# Altium project MandevicesGPSGSM.PrjPcb
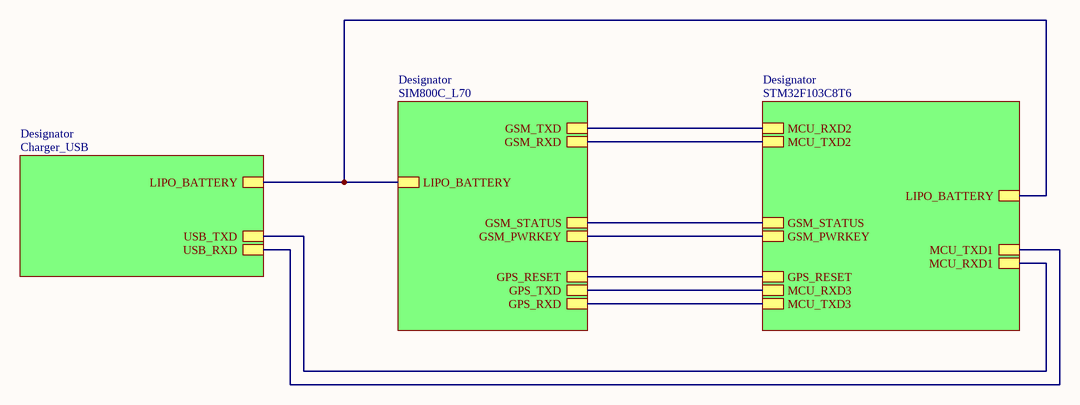
[diagram p0: Sheet1.SchDoc]
5 sheets, 103 parts. Net scope: hierarchical (ports join the sheet entries above them; power ports are global).
Board file: PCB1.PcbDoc
Sheets:
  Sheet1.SchDoc
    Designator = SIM800C_L70.SchDoc
    Designator = STM32F103C8T6.SchDoc
    Designator = Charger_USB.SchDoc
  Diagram.SchDoc

## Sheet Sheet1.SchDoc
size A; SheetNumber: 1; SheetTotal: 4

### Sub-sheets
Designator = SIM800C_L70: GSM_TXD, GSM_RXD, GSM_STATUS, GSM_PWRKEY, LIPO_BATTERY, GPS_TXD, GPS_RXD, GPS_RESET
Designator = STM32F103C8T6: MCU_RXD2, MCU_TXD2, GSM_STATUS, GSM_PWRKEY, MCU_RXD3, MCU_TXD3, GPS_RESET, LIPO_BATTERY, MCU_TXD1, MCU_RXD1
Designator = Charger_USB: LIPO_BATTERY, USB_TXD, USB_RXD

### Nets
LIPO_BATTERY: sheet Designator/LIPO_BATTERY, sheet Designator/LIPO_BATTERY, sheet Designator/LIPO_BATTERY
NetR9_1: sheet Designator/GPS_RESET, sheet Designator/GPS_RESET
NetR20_1: sheet Designator/GSM_RXD, sheet Designator/MCU_TXD2
NetR21_1: sheet Designator/GSM_TXD, sheet Designator/MCU_RXD2
NetR24_1: sheet Designator/GSM_PWRKEY, sheet Designator/GSM_PWRKEY
NetU4_2: sheet Designator/MCU_RXD1, sheet Designator/USB_TXD
NetU4_3: sheet Designator/MCU_TXD1, sheet Designator/USB_RXD
NetU5_42: sheet Designator/GSM_STATUS, sheet Designator/GSM_STATUS
NetU6_2: sheet Designator/GPS_TXD, sheet Designator/MCU_RXD3
NetU6_3: sheet Designator/GPS_RXD, sheet Designator/MCU_TXD3

## Sheet SIM800C_L70.SchDoc
size A3; SheetNumber: 3; SheetTotal: 4
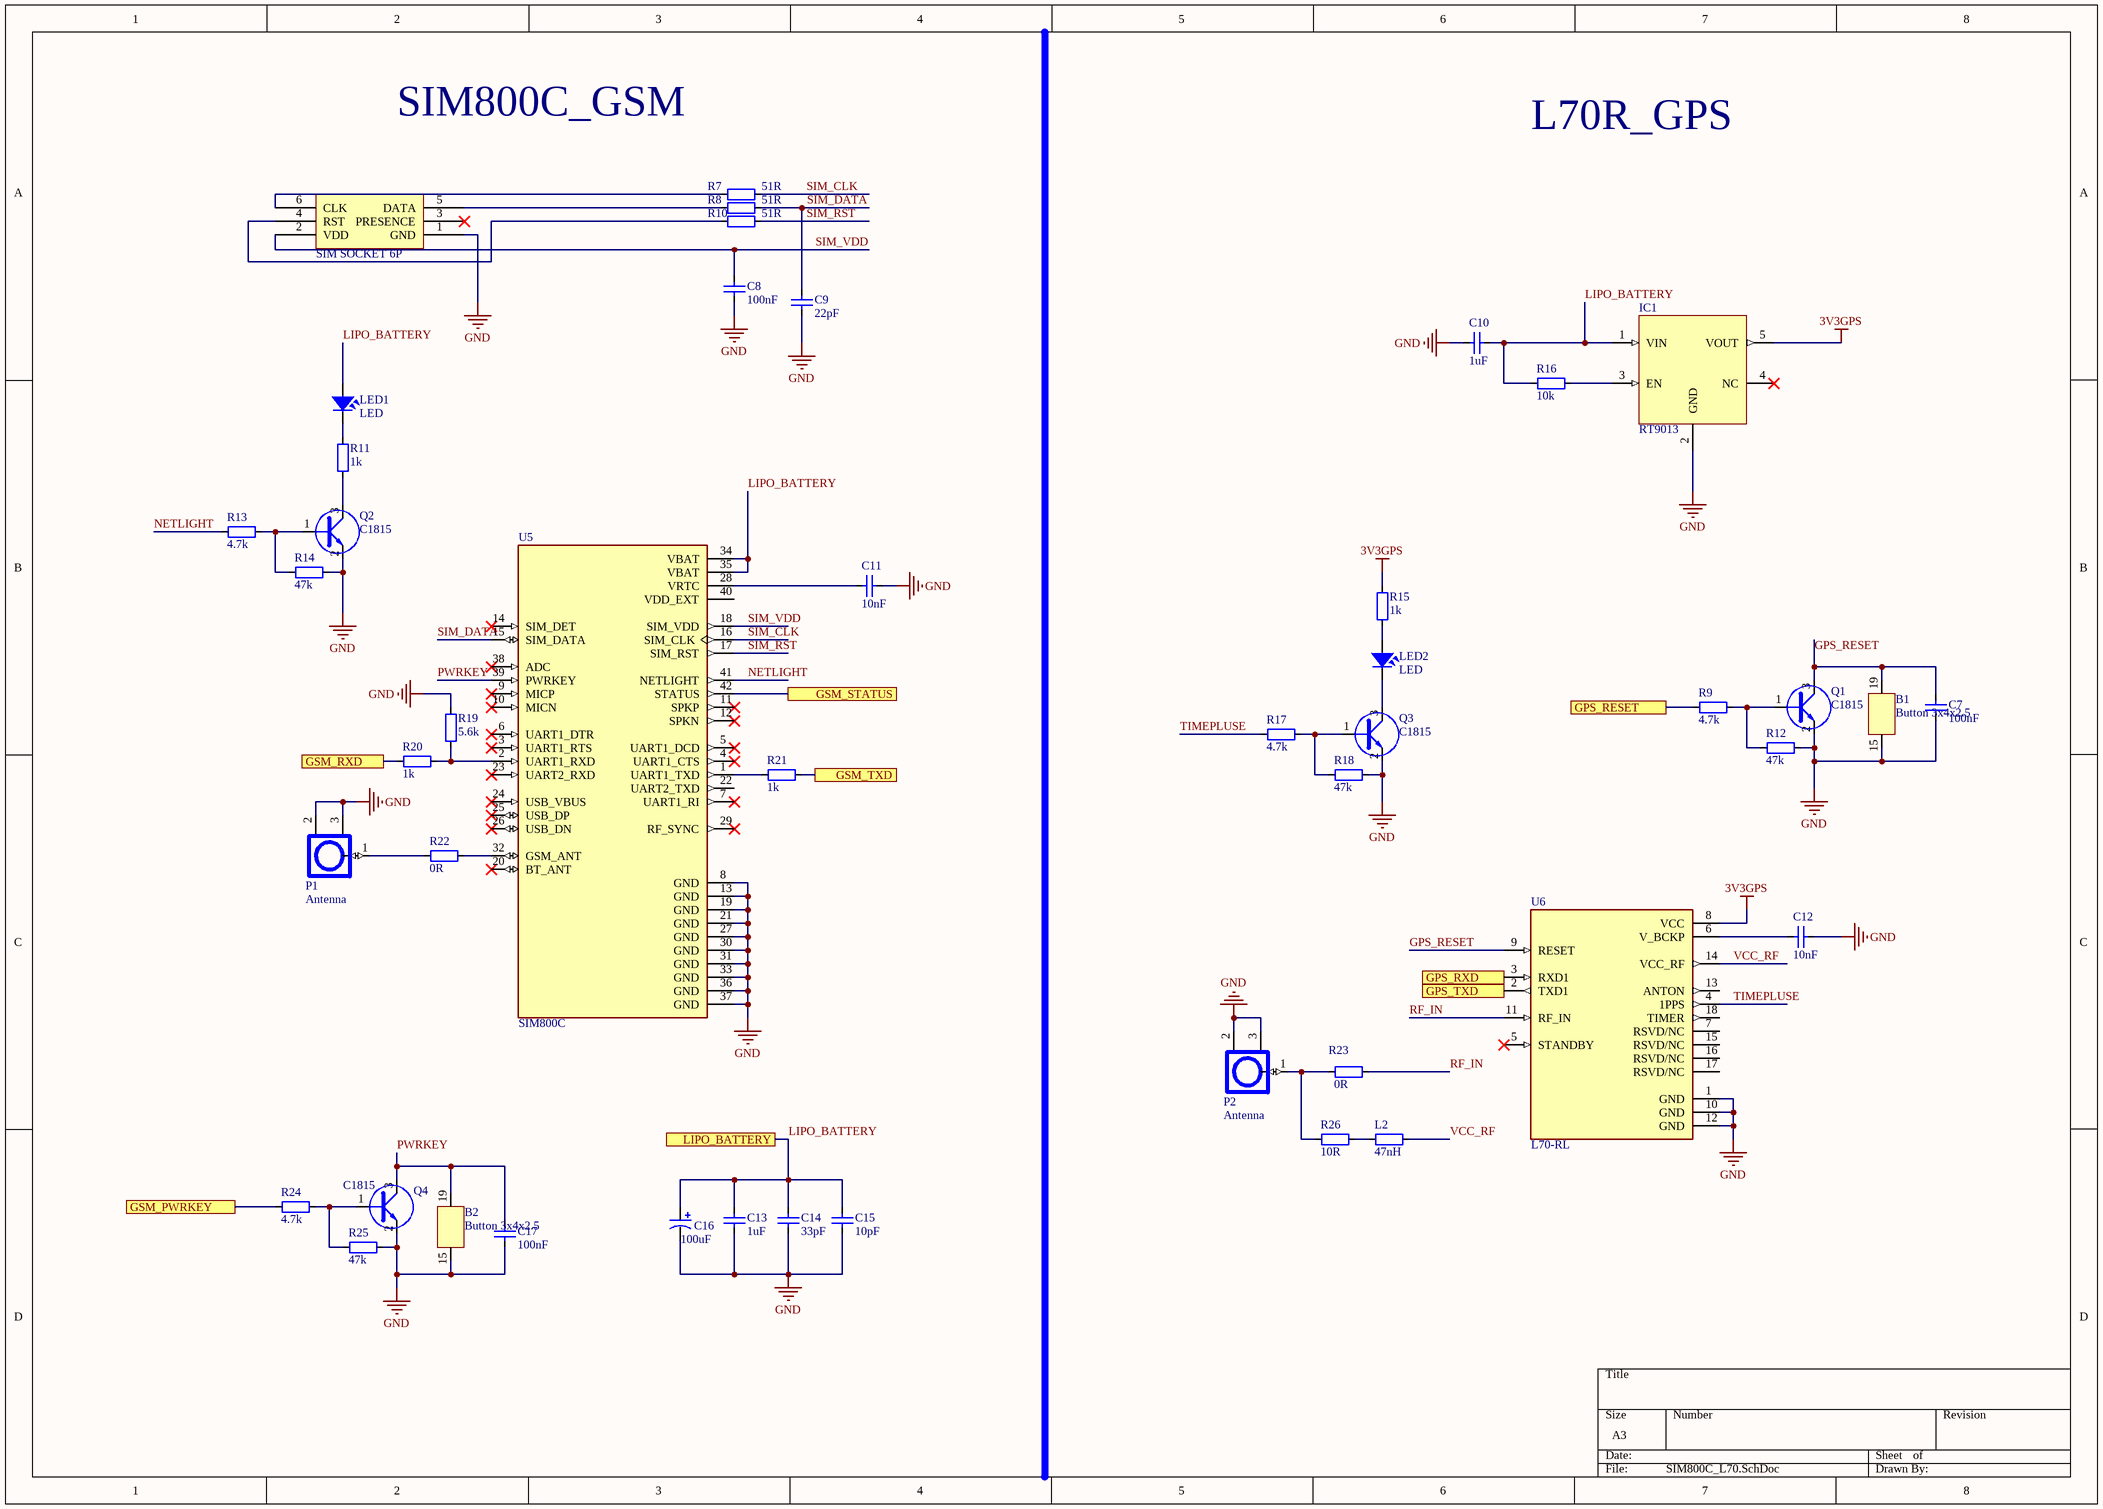
[diagram p1: SIM800C_L70.SchDoc]

### Parts
B1  Button 3x4x2.5  [Button 3x4x2.5]
B2  Button 3x4x2.5  [Button 3x4x2.5]
C7  100nF  [CAP_0805]
C8  100nF  [CAP_0805]
C9  22pF  [CAP_0805]
C10  1uF  [CAP_0805]
C11  10nF  [CAP_0805]
C12  10nF  [CAP_0805]
C13  1uF  [CAP_0805]
C14  33pF  [CAP_0805]
C15  10pF  [CAP_0805]
C16  100uF  [CAP_7343]
C17  100nF  [CAP_0805]
IC1  RT9013  [SOT23-5]
L2  47nH  [RES-SMD-0805]
LED1  LED  [LED-0805-Red]
LED2  LED  [LED-0805-Red]
P1  Antenna  [IPXS]
P2  Antenna  [IPXS]
Q1  C1815  [SOT23D]
Q2  C1815  [SOT23D]
Q3  C1815  [SOT23D]
Q4  C1815  [SOT23D]
R7  51R  [RES-SMD-0805]
R8  51R  [RES-SMD-0805]
R9  4.7k  [RES-SMD-0805]
R10  51R  [RES-SMD-0805]
R11  1k  [RES-SMD-0805]
R12  47k  [RES-SMD-0805]
R13  4.7k  [RES-SMD-0805]
R14  47k  [RES-SMD-0805]
R15  1k  [RES-SMD-0805]
R16  10k  [RES-SMD-0805]
R17  4.7k  [RES-SMD-0805]
R18  47k  [RES-SMD-0805]
R19  5.6k  [RES-SMD-0805]
R20  1k  [RES-SMD-0805]
R21  1k  [RES-SMD-0805]
R22  0R  [RES-SMD-0805]
R23  0R  [RES-SMD-0805]
R24  4.7k  [RES-SMD-0805]
R25  47k  [RES-SMD-0805]
R26  10R  [RES-SMD-0805]
SIM1  SIM SOCKET 6P  [SIM SOCKET 6P]
U5  SIM800C  [LCC110P1570X1760X250-42N]
U6  L70-RL  [XCVR_L70-RL]

### Ports
GPS_RESET, GPS_RXD, GPS_TXD, GSM_PWRKEY, GSM_RXD, GSM_STATUS, GSM_TXD, LIPO_BATTERY

### Nets
3V3GPS: IC1.5(VOUT) R15.2 U6.8(VCC)
GND: B1.15 B2.15 C7.1 C8.2 C9.1 C10.1 C11.2 C12.2 C13.2 C14.2 C15.2 C16.2 C17.1 IC1.2(GND) P1.2 P1.3 P2.2 P2.3 Q1.2(E) Q2.2(E) Q3.2(E) Q4.2(E) R12.2 R14.2 R18.2 R19.1 R25.2 SIM1.1(GND) U5.8(GND) U5.13(GND) U5.19(GND) U5.21(GND) U5.27(GND) U5.30(GND) U5.31(GND) U5.33(GND) U5.36(GND) U5.37(GND) U6.1(GND) U6.10(GND) U6.12(GND)
GPS_RESET: B1.19 C7.2 Q1.3(C) U6.9(RESET)
LIPO_BATTERY: C10.2 C13.1 C14.1 C15.1 C16.1 IC1.1(VIN) LED1.1 R16.2 U5.34(VBAT) U5.35(VBAT) ; port LIPO_BATTERY
NETLIGHT: R13.1 U5.41(NETLIGHT)
PWRKEY: B2.19 C17.2 Q4.3(C) U5.39(PWRKEY)
RF_IN: R23.2 U6.11(RF_IN)
SIM_CLK: R7.2 U5.16(SIM_CLK)
SIM_DATA: C9.2 R8.2 U5.15(SIM_DATA)
SIM_RST: R10.2 U5.17(SIM_RST)
SIM_VDD: C8.1 SIM1.2(VDD) U5.18(SIM_VDD)
TIMEPLUSE: R17.1 U6.4(1PPS)
VCC_RF: L2.2 U6.14(VCC_RF)
NetC11_1: C11.1 U5.28(VRTC)
NetC12_1: C12.1 U6.6(V_BCKP)
NetIC1_3: IC1.3(EN) R16.1
NetL2_1: L2.1 R26.2
NetLED1_2: LED1.2 R11.2
NetLED2_1: LED2.1 R15.1
NetLED2_2: LED2.2 Q3.3(C)
NetP1_1: P1.1 R22.2
NetP2_1: P2.1 R23.1 R26.1
NetQ1_1: Q1.1(B) R9.2 R12.1
NetQ2_1: Q2.1(B) R13.2 R14.1
NetQ2_3: Q2.3(C) R11.1
NetQ3_1: Q3.1(B) R17.2 R18.1
NetQ4_1: Q4.1(B) R24.2 R25.1
NetR7_1: R7.1 SIM1.6(CLK)
NetR8_1: R8.1 SIM1.5(DATA)
NetR9_1: R9.1 ; port GPS_RESET
NetR10_1: R10.1 SIM1.4(RST)
NetR19_2: R19.2 R20.2 U5.2(UART1_RXD)
NetR20_1: R20.1 ; port GSM_RXD
NetR21_1: R21.1 ; port GSM_TXD
NetR21_2: R21.2 U5.1(UART1_TXD)
NetR22_1: R22.1 U5.32(GSM_ANT)
NetR24_1: R24.1 ; port GSM_PWRKEY
NetU5_42: U5.42(STATUS) ; port GSM_STATUS
NetU6_2: U6.2(TXD1) ; port GPS_TXD
NetU6_3: U6.3(RXD1) ; port GPS_RXD

Not connected (* = marked no-connect by the designer): IC1 4(NC)*; SIM1 3(PRESENCE)*; U5 3(UART1_RTS)* 4(UART1_CTS)* 5(UART1_DCD)* 6(UART1_DTR)* 7(UART1_RI)* 9(MICP)* 10(MICN)* 11(SPKP)* 12(SPKN)* 14(SIM_DET)* 20(BT_ANT)* 22(UART2_TXD) 23(UART2_RXD)* 24(USB_VBUS)* 25(USB_DP)* 26(USB_DN)* 29(RF_SYNC)* 38(ADC)* 40(VDD_EXT); U6 5(STANDBY)* 7(RSVD/NC) 13(ANTON) 15(RSVD/NC) 16(RSVD/NC) 17(RSVD/NC) 18(TIMER)

### Notes on the sheet
- SIM800C_GSM
- L70R_GPS

### Library data of the parts
C7-C15 C17 = CapSMD: Capacitor; Value: 33p; Published: 8-Jun-2000; LatestRevisionDate: 17-Jul-2002; LatestRevisionNote: Re-released for DXP Platform.; PackageReference: RAD-0.3; Publisher: Altium Limited
C16 = CAP_TAN_SMD: Polazied Tantalum Capacitor
IC1 = RT9013: RT9013-33GB IC REG LINEAR 3.3V 500mA SOT23-5
L2 R7-R26 = Resistor - SMD: Resistor; Manufacturer: Generic Components; Class: Passive; Published: 08/06/2000; Publisher: Altium Hobart Technology Centre
LED1 LED2 = LED: LED Single colour Green and Red; Value: LED 3 ly Single Colour
P1 P2 = IPXSx66: Antenna GSM GPS
Q1-Q4 = 2SC1815: NPN 600mW, ECB; Value: C1815
SIM1 = SIM SOCKET 6P: Ma_Hang: MH001823; Ten_LK: Socket SIM 6P SK06
U5 = SIM800C: Module: GSM/Bluetooth; GPRS; 2G; 1800MHz, 900MHz; 85.6kbps; SMD; MF: Simcom; MP: SIM800C; Availability: Unavailable; Package: None; Value: *; Price: None; SnapEDA_Link: https://www.snapeda.com/parts/SIM800C/SIMcom%20Wireless%20solutions%20Co.%2CLtd/view-part/571323/?ref=snap
U6 = L70-RL: L70-RL, a low cost ROM-based GPS module, brings the high performance of MTK positioning engine to industrial applications with its compact profile, ultra low power consumption and fast positioning capability; MF: Quectel; Availability: Not in stock; Price: None; Package: None; SnapEDA_Link: https://www.snapeda.com/parts/L70-RL/Quectel/view-part/?ref=snap; MP: L70-RL; Value: *; Check_prices: https://www.snapeda.com/parts/L70-RL/Quectel/view-part/?ref=eda

## Sheet STM32F103C8T6.SchDoc
size A3; SheetNumber: 4; SheetTotal: 4
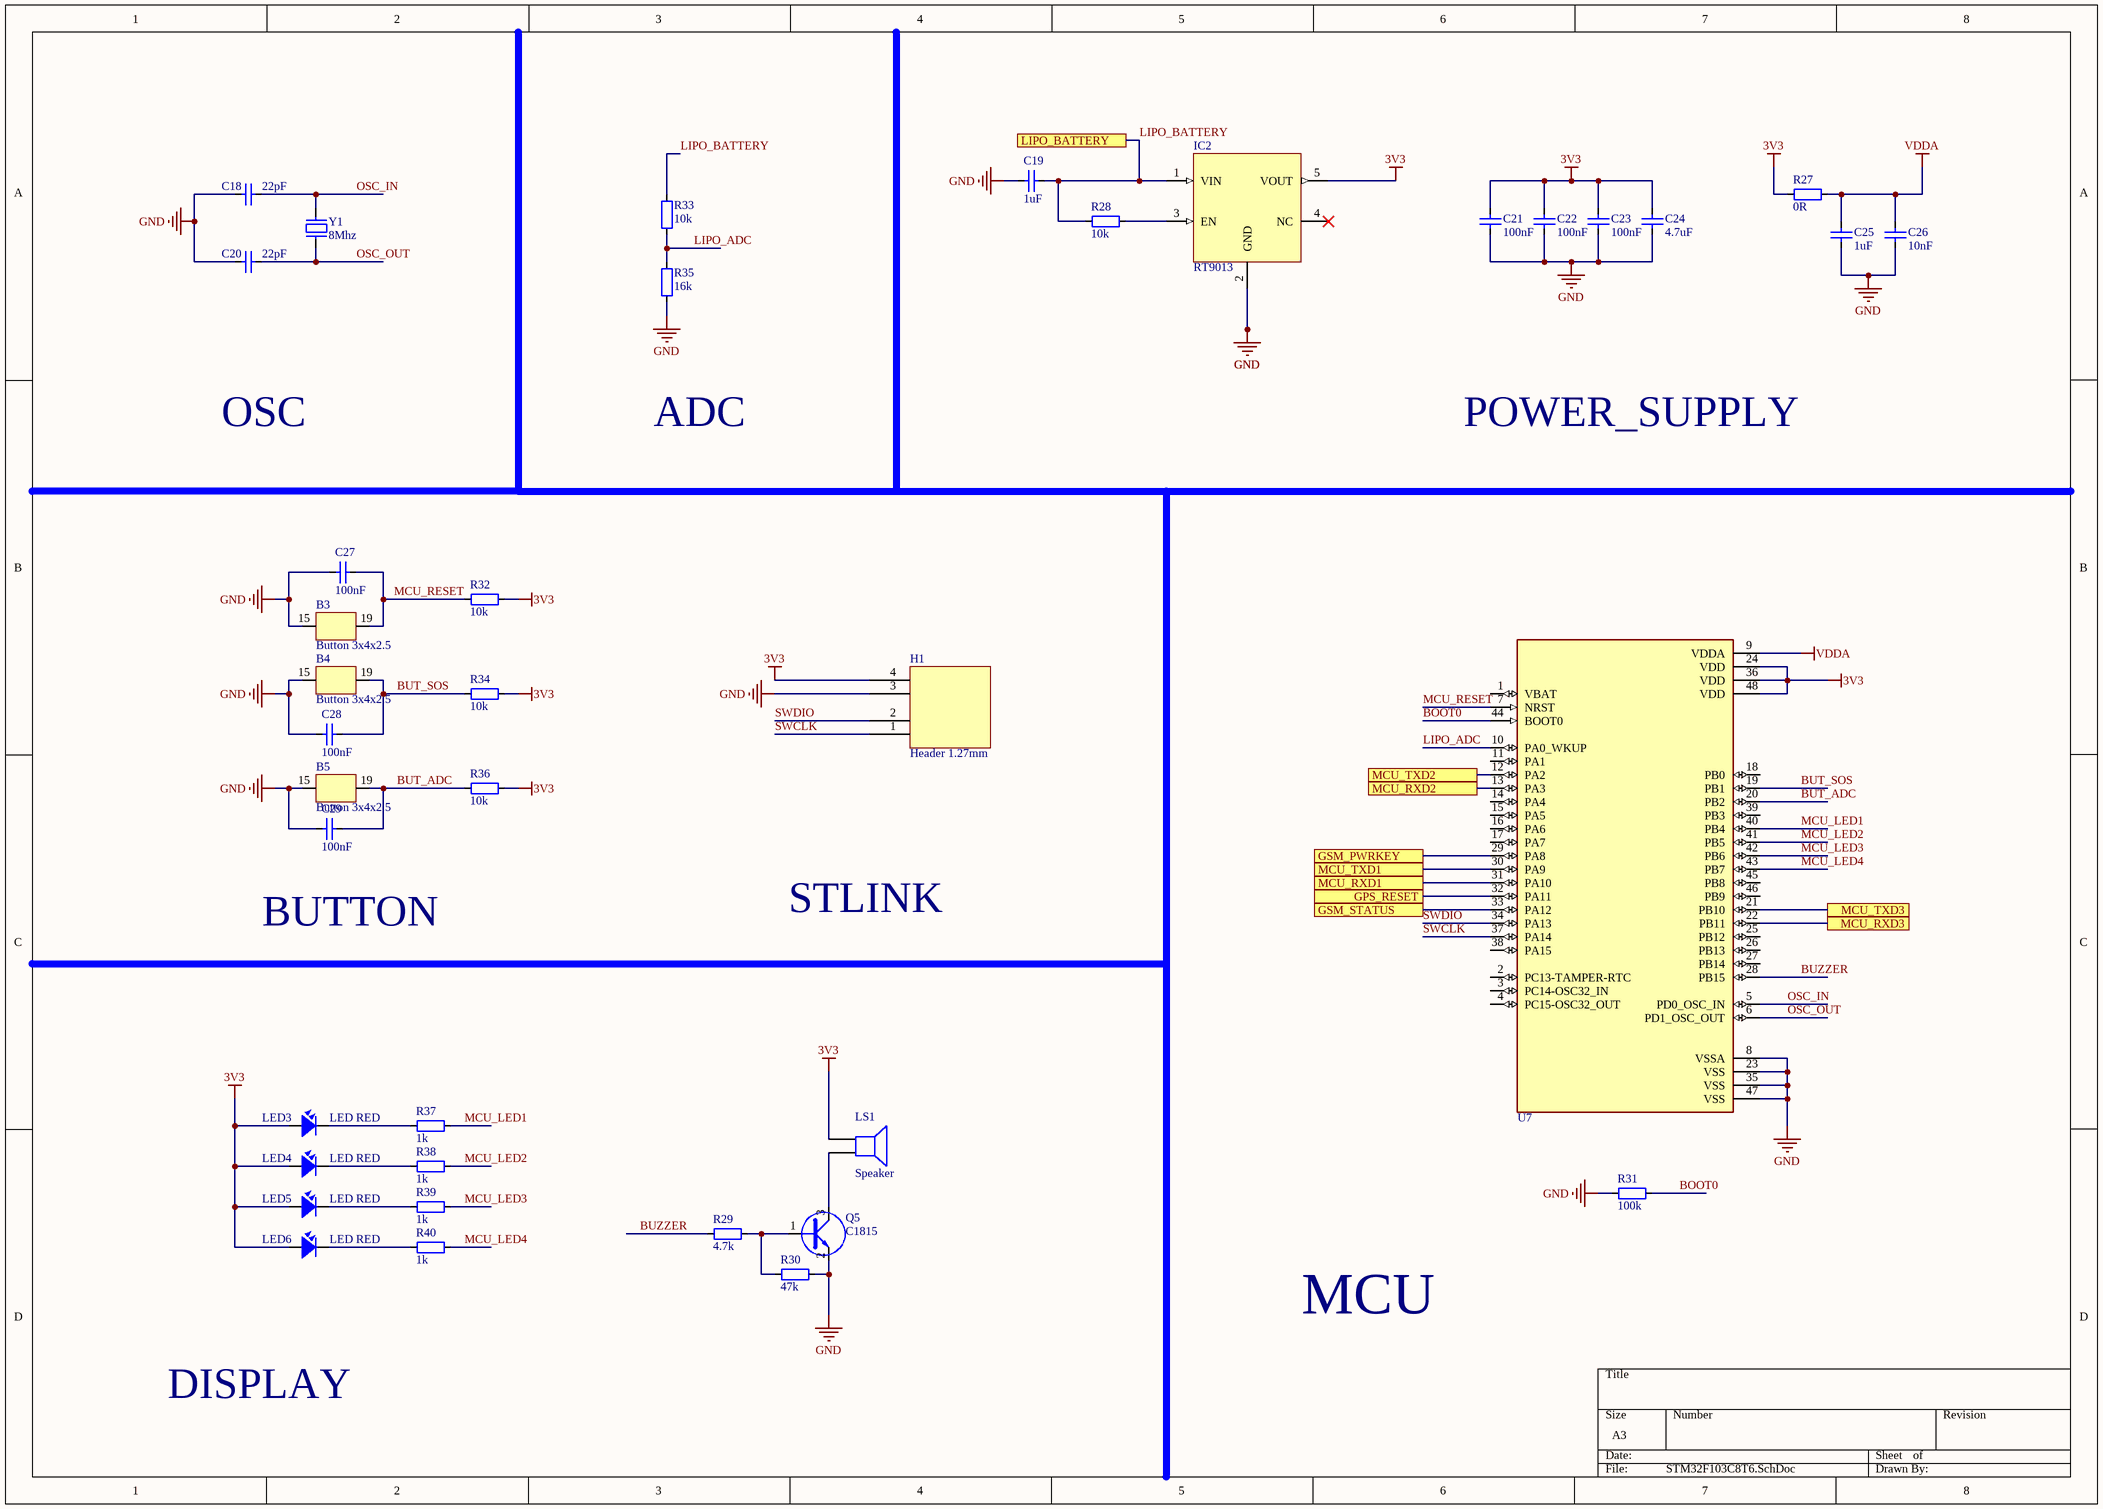
[diagram p2: STM32F103C8T6.SchDoc]

### Parts
B3  Button 3x4x2.5  [Button 3x4x2.5]
B4  Button 3x4x2.5  [Button 3x4x2.5]
B5  Button 3x4x2.5  [Button 3x4x2.5]
C18  22pF  [CAP_0805]
C19  1uF  [CAP_0805]
C20  22pF  [CAP_0805]
C21  100nF  [CAP_0805]
C22  100nF  [CAP_0805]
C23  100nF  [CAP_0805]
C24  4.7uF  [CAP_0805]
C25  1uF  [CAP_0805]
C26  10nF  [CAP_0805]
C27  100nF  [CAP_0805]
C28  100nF  [CAP_0805]
C29  100nF  [CAP_0805]
H1  Header 1.27mm  [Header 1.27mm]
IC2  RT9013  [SOT23-5]
LED3  LED RED  [LED-0805-Red]
LED4  LED RED  [LED-0805-Red]
LED5  LED RED  [LED-0805-Red]
LED6  LED RED  [LED-0805-Red]
LS1  Speaker  [SPEAKER]
Q5  C1815  [SOT23D]
R27  0R  [RES-SMD-0805]
R28  10k  [RES-SMD-0805]
R29  4.7k  [RES-SMD-0805]
R30  47k  [RES-SMD-0805]
R31  100k  [RES-SMD-0805]
R32  10k  [RES-SMD-0805]
R33  10k  [RES-SMD-0805]
R34  10k  [RES-SMD-0805]
R35  16k  [RES-SMD-0805]
R36  10k  [RES-SMD-0805]
R37  1k  [RES-SMD-0805]
R38  1k  [RES-SMD-0805]
R39  1k  [RES-SMD-0805]
R40  1k  [RES-SMD-0805]
U7  STM32  [LQFP 48]  (value not drawn)
Y1  8Mhz  [Thach Anh 2 chan SMD5032]

### Ports
GPS_RESET, GSM_PWRKEY, GSM_STATUS, LIPO_BATTERY, MCU_RXD1, MCU_RXD2, MCU_RXD3, MCU_TXD1, MCU_TXD2, MCU_TXD3

### Nets
3V3: C21.2 C22.2 C23.2 C24.2 H1.4 IC2.5(VOUT) LED3.1 LED4.1 LED5.1 LED6.1 LS1.1 R27.2 R32.1 R34.1 R36.1 U7.24(VDD) U7.36(VDD) U7.48(VDD)
GND: B3.15 B4.15 B5.15 C18.1 C19.1 C20.1 C21.1 C22.1 C23.1 C24.1 C25.1 C26.1 C27.1 C28.1 C29.1 H1.3 IC2.2(GND) Q5.2(E) R30.2 R31.2 R35.2 U7.8(VSSA) U7.23(VSS) U7.35(VSS) U7.47(VSS)
VDDA: C25.2 C26.2 R27.1 U7.9(VDDA)
BOOT0: R31.1 U7.44(BOOT0)
BUT_ADC: B5.19 C29.2 R36.2 U7.20(PB2)
BUT_SOS: B4.19 C28.2 R34.2 U7.19(PB1)
BUZZER: R29.1 U7.28(PB15)
LIPO_ADC: R33.2 R35.1 U7.10(PA0_WKUP)
LIPO_BATTERY: C19.2 IC2.1(VIN) R28.2 R33.1 ; port LIPO_BATTERY
MCU_LED1: R37.1 U7.40(PB4)
MCU_LED2: R38.1 U7.41(PB5)
MCU_LED3: R39.1 U7.42(PB6)
MCU_LED4: R40.1 U7.43(PB7)
MCU_RESET: B3.19 C27.2 R32.2 U7.7(NRST)
OSC_IN: C18.2 U7.5(PD0_OSC_IN) Y1.2
OSC_OUT: C20.2 U7.6(PD1_OSC_OUT) Y1.1
SWCLK: H1.1 U7.37(PA14)
SWDIO: H1.2 U7.34(PA13)
NetIC2_3: IC2.3(EN) R28.1
NetLED3_2: LED3.2 R37.2
NetLED4_2: LED4.2 R38.2
NetLED5_2: LED5.2 R39.2
NetLED6_2: LED6.2 R40.2
NetLS1_2: LS1.2 Q5.3(C)
NetQ5_1: Q5.1(B) R29.2 R30.1
NetR9_1: U7.32(PA11) ; port GPS_RESET
NetR20_1: U7.12(PA2) ; port MCU_TXD2
NetR21_1: U7.13(PA3) ; port MCU_RXD2
NetR24_1: U7.29(PA8) ; port GSM_PWRKEY
NetU4_2: U7.31(PA10) ; port MCU_RXD1
NetU4_3: U7.30(PA9) ; port MCU_TXD1
NetU5_42: U7.33(PA12) ; port GSM_STATUS
NetU6_2: U7.22(PB11) ; port MCU_RXD3
NetU6_3: U7.21(PB10) ; port MCU_TXD3

Not connected (* = marked no-connect by the designer): IC2 4(NC)*; U7 1(VBAT) 2(PC13-TAMPER-RTC) 3(PC14-OSC32_IN) 4(PC15-OSC32_OUT) 11(PA1) 14(PA4) 15(PA5) 16(PA6) 17(PA7) 18(PB0) 25(PB12) 26(PB13) 27(PB14) 38(PA15) 39(PB3) 45(PB8) 46(PB9)

### Notes on the sheet
- OSC
- ADC
- POWER_SUPPLY
- STLINK
- BUTTON
- MCU
- DISPLAY

### Library data of the parts
C18-C29 = CapSMD: Capacitor; Value: 33p; Published: 8-Jun-2000; LatestRevisionDate: 17-Jul-2002; LatestRevisionNote: Re-released for DXP Platform.; PackageReference: RAD-0.3; Publisher: Altium Limited
IC2 = RT9013: as IC1 on sheet SIM800C_L70
LED3-LED6 = LED: as LED1 on sheet SIM800C_L70
LS1 = Speaker: Còi chíp 3V; Published: 24-Mar-1999; LatestRevisionDate: 17-Jul-2002; LatestRevisionNote: Re-released for DXP Platform.; PackageReference: PIN2; Publisher: Altium Limited
Q5 = 2SC1815: NPN 600mW, ECB; Value: C1815
R27-R40 = Resistor - SMD: as L2 on sheet SIM800C_L70; Published: 08/06/2000; Publisher: Altium Hobart Technology Centre
U7 = STM32F103C8T6: STM32 ARM-based 32-bit MCU with 64 Kbytes Flash, 64-pin LQFP, Industrial Temperature
Y1 = Thach Anh 2 chan SMD 5032: Crystal For all Crystal 2pin.; Value: 4Mhz

## Sheet Charger_USB.SchDoc
size A; SheetNumber: 2; SheetTotal: 4
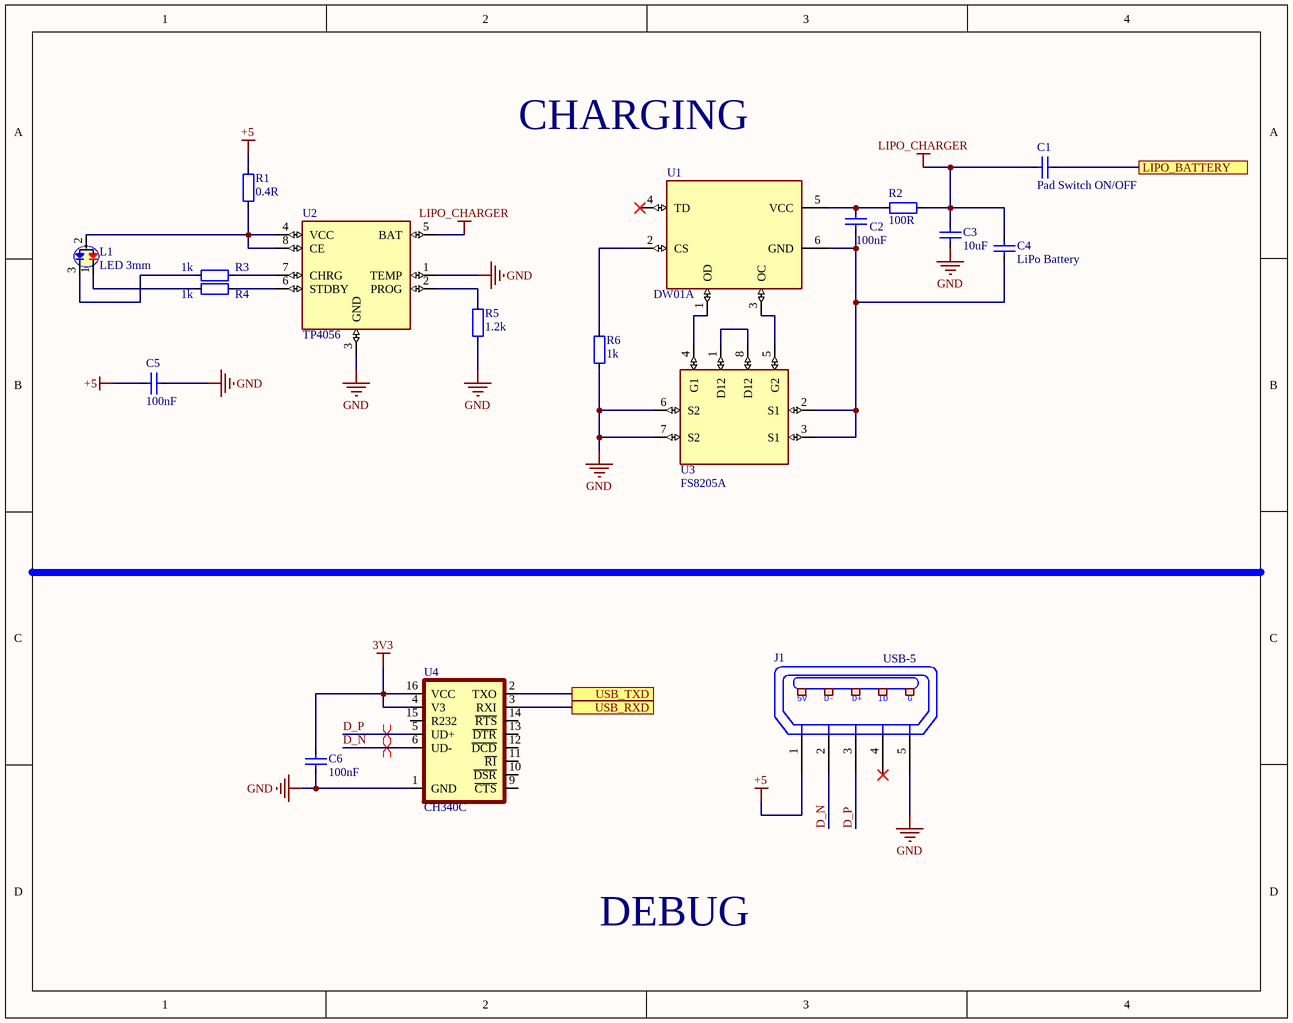
[diagram p3: Charger_USB.SchDoc]

### Parts
C1  Pad Switch ON/OFF  [CAP_3216]
C2  100nF  [CAP_0805]
C3  10uF  [CAP_0805]
C4  LiPo Battery  [CAP_0805]
C5  100nF  [CAP_0805]
C6  100nF  [CAP_0805]
J1  USB-5  [USB-M1]
L1  LED 3mm  [LED-3MM 2 MAU]
R1  0.4R  [RES-SMD-0805]
R2  100R  [RES-SMD-0805]
R3  1k  [RES-SMD-0805]
R4  1k  [RES-SMD-0805]
R5  1.2k  [RES-SMD-0805]
R6  1k  [RES-SMD-0805]
U1  DW01A  [SOT23-6]
U2  TP4056  [TP4056]
U3  FS8205A  [FS8205A]
U4  CH340C  [SO016]

### Ports
LIPO_BATTERY, USB_RXD, USB_TXD

### Nets
3V3: C6.2 U4.4(V3) U4.16(VCC)
+5: C5.2 J1.1(P1) R1.1
GND: C3.2 C5.1 C6.1 J1.5(P5) R5.1 R6.1 U2.1(TEMP) U2.3(GND) U3.6(S2) U3.7(S2) U4.1(GND)
LIPO_CHARGER: C1.1 C3.1 C4.1 R2.2 U2.5(BAT)
D_N: J1.2(P2) U4.6(UD-)
D_P: J1.3(P3) U4.5(UD+)
LIPO_BATTERY: C1.2 ; port LIPO_BATTERY
NetC2_1: C2.1 R2.1 U1.5(VCC)
NetC2_2: C2.2 C4.2 U1.6(GND) U3.2(S1) U3.3(S1)
NetL1_1: L1.1(Katot_2) R4.2
NetL1_2: L1.2(ANOT) R1.2 U2.4(VCC) U2.8(CE)
NetL1_3: L1.3(Katot_1) R3.2
NetR3_1: R3.1 U2.7(CHRG)
NetR4_1: R4.1 U2.6(STDBY)
NetR5_2: R5.2 U2.2(PROG)
NetR6_2: R6.2 U1.2(CS)
NetU1_1: U1.1(OD) U3.4(G1)
NetU1_3: U1.3(OC) U3.5(G2)
NetU3_1: U3.1(D12) U3.8(D12)
NetU4_2: U4.2(TXO) ; port USB_TXD
NetU4_3: U4.3(RXI) ; port USB_RXD

Not connected (* = marked no-connect by the designer): J1 4(P4)*; U1 4(TD)*; U4 9(~{CTS}) 10(~{DSR}) 11(~{RI}) 12(~{DCD}) 13(~{DTR}) 14(~{RTS}) 15(R232)

### Layout directives
differential pair: D_N, D_P

### Notes on the sheet
- CHARGING
- DEBUG
- (in symbol USB-5) 5V; D-; D+; ID; G

### Library data of the parts
C1-C6 = CapSMD: Capacitor; Value: 33p; Published: 8-Jun-2000; LatestRevisionDate: 17-Jul-2002; LatestRevisionNote: Re-released for DXP Platform.; PackageReference: RAD-0.3; Publisher: Altium Limited
J1 = USB-5: Manufacturer: FCI; Manufacturer Part Number: 10118193-0001LF; Connector Type: USB - micro B; Number of Contacts: 5; Gender: Receptacle; Specifications: USB 2.0; .Creator: MM; .Checked PCB: RF; Supplier 1: Digi-Key; RoHS: RoHS Compliant; Category: Connectors, Interconnects; Stock 1: 28642; Pricing 1: 1=0.46, 10=0.433, 25=0.3712, 50=0.3156, 100=0.3032, 250=0.27224, 500=0.25988 (USD); Packaging: Cut Tape (CT); Mounting Type: Surface Mount, Right Angle, Horizontal; Features: Shielded, Solder Retention; Ingress Protection: -; ComponentLink1URL: http://portal.fciconnect.com/Comergent//fci/drawing/10118193.pdf; ComponentLink1Description: http://portal.fciconnect.com/Comergent//fci/drawing/10118193.pdf; Supplier Part Number 1: 609-4616-1-ND; .Checked SCH: MM
L1 = LED 3m 2 mau Anot chung: Cắm; Don_Vi: Con; Ma_Hang: MH005371; Ten_Linh_Kien: Led 3MM 2 Mầu Anot Sáng Đục (5c); Ghi_Chu: *; Kieu_Chan: *; Chung_Loai: Cắm
R1-R6 = Resistor - SMD: as L2 on sheet SIM800C_L70; Published: 08/06/2000; Publisher: Altium Hobart Technology Centre
U1 = DW01A: One Cell Lithium-ion/Polymer Battery Protection IC
U2 = TP4056: Complete single cell Li-Ion battery with a constant current / constant voltage linear charger
U4 = CH340C: USB to serial chip CH340; MF: WCH; Package: Package; Check_prices: https://www.snapeda.com/parts/CH340C/WCH/view-part/5428851/?ref=eda; Value: *; Price: None; MP: CH340C; Availability: Unavailable; SnapEDA_Link: https://www.snapeda.com/parts/CH340C/WCH/view-part/5428851/?ref=snap

## Sheet Diagram.SchDoc
size A

### Notes on the sheet
- Title
- Size:
- Date:
- A
- Number:
- Time:
- Revision:
- Sheet
- of
- File:
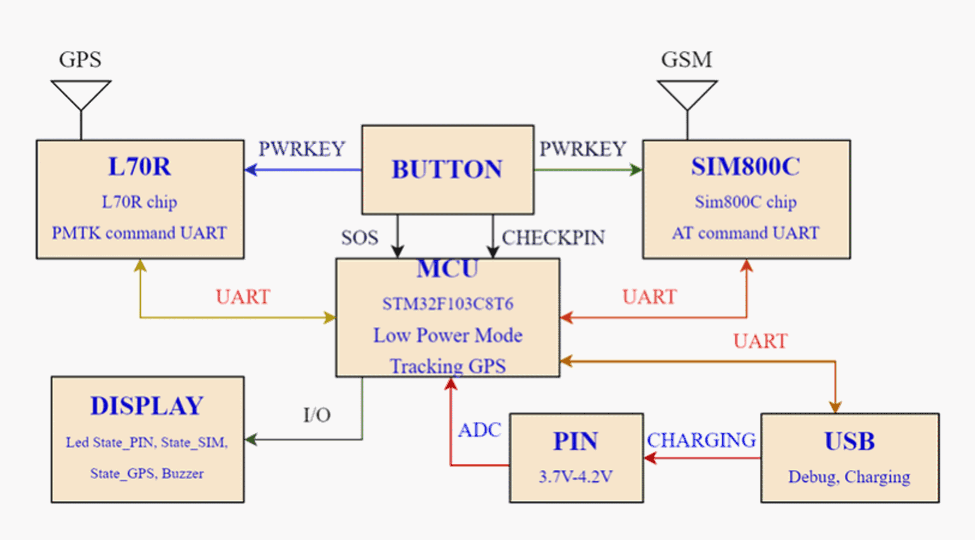
[diagram p4: Diagram.SchDoc]

## Nets that join several sheets
3V3: STM32F103C8T6 (18 pins), Charger_USB (C6.2 U4.4 U4.16)
GND: SIM800C_L70 (41 pins), STM32F103C8T6 (25 pins), Charger_USB (11 pins)
LIPO_BATTERY: SIM800C_L70 (10 pins), STM32F103C8T6 (C19.2 IC2.1 R28.2 R33.1), Charger_USB (C1.2)
NetR9_1: SIM800C_L70 (R9.1), STM32F103C8T6 (U7.32)
NetR20_1: SIM800C_L70 (R20.1), STM32F103C8T6 (U7.12)
NetR21_1: SIM800C_L70 (R21.1), STM32F103C8T6 (U7.13)
NetR24_1: SIM800C_L70 (R24.1), STM32F103C8T6 (U7.29)
NetU4_2: STM32F103C8T6 (U7.31), Charger_USB (U4.2)
NetU4_3: STM32F103C8T6 (U7.30), Charger_USB (U4.3)
NetU5_42: SIM800C_L70 (U5.42), STM32F103C8T6 (U7.33)
NetU6_2: SIM800C_L70 (U6.2), STM32F103C8T6 (U7.22)
NetU6_3: SIM800C_L70 (U6.3), STM32F103C8T6 (U7.21)